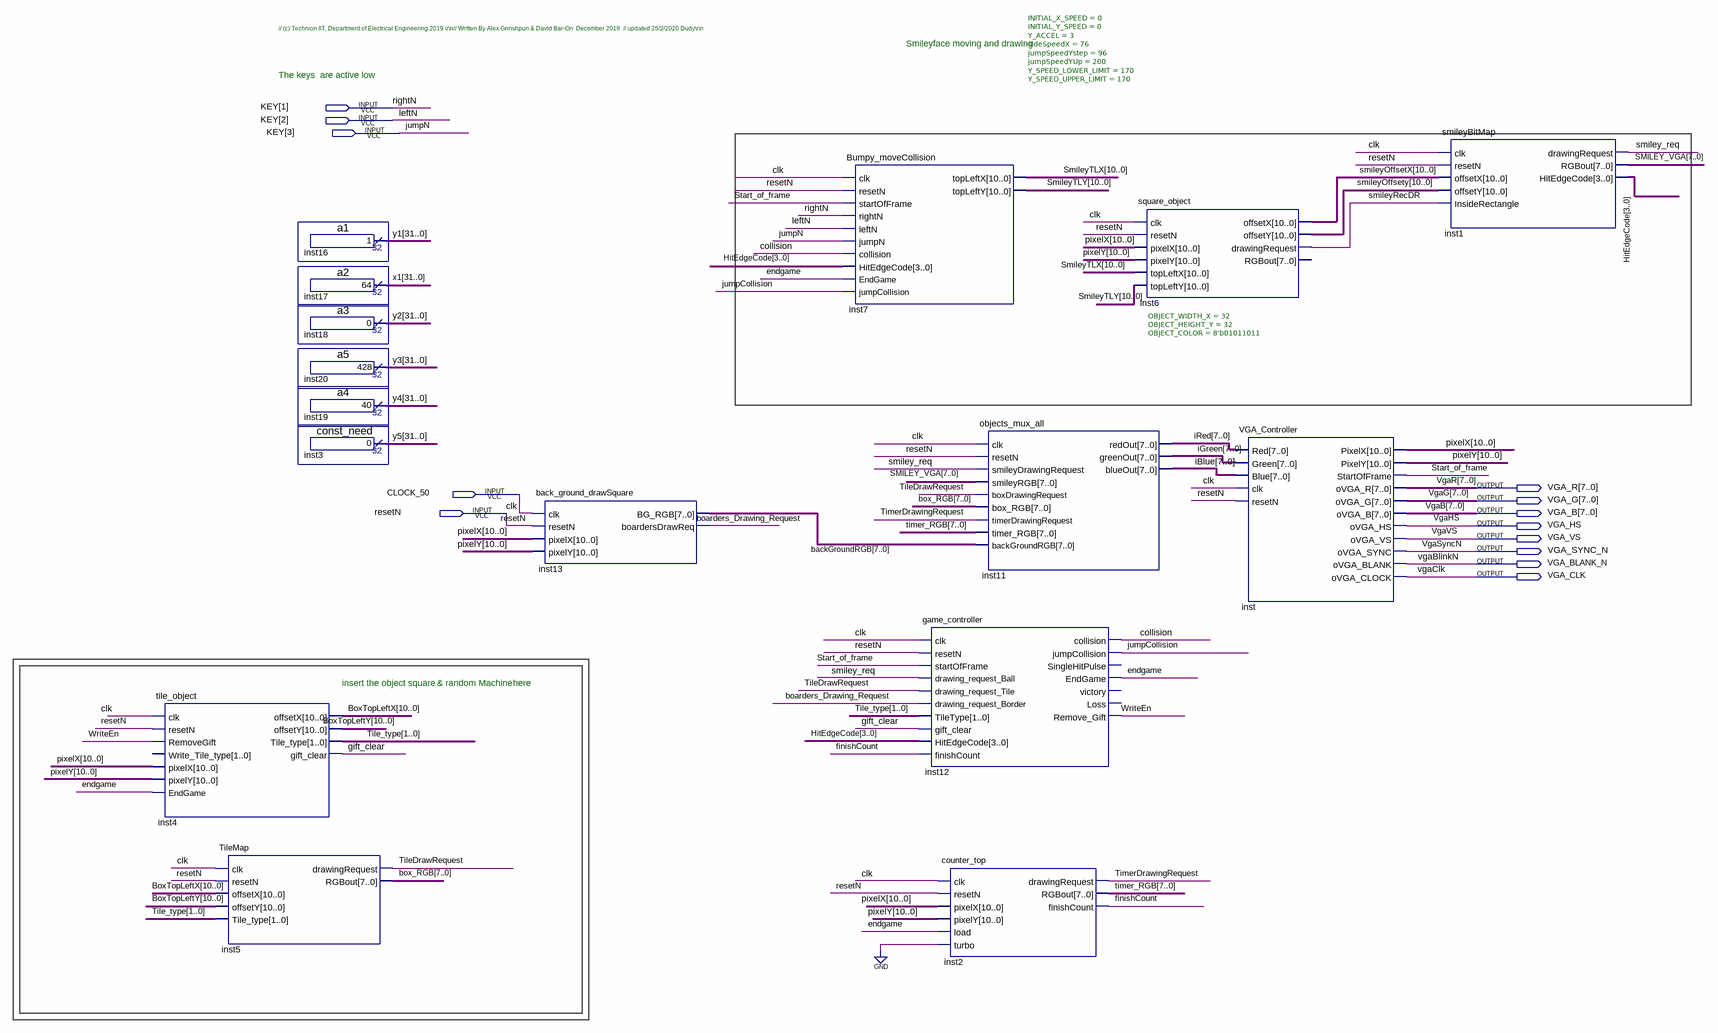
[diagram p0: schematic sheet]
// Quartus schematic top_project_demo.bdf as structural Verilog: 16 symbols, 13 pins
module top_project_demo (
  input  [3:1] KEY,
  input  CLOCK_50,
  input  resetN,
  output [7:0] VGA_R,
  output [7:0] VGA_G,
  output [7:0] VGA_B,
  output VGA_HS,
  output VGA_VS,
  output VGA_SYNC_N,
  output VGA_BLANK_N,
  output VGA_CLK
);

  wire boarders_Drawing_Request, collision, endgame, finishCount, gift_clear, jumpCollision, smiley_req,
       smileyRecDR, Start_of_frame, TileDrawRequest, TimerDrawingRequest, WriteEn;
  wire [1:0] Tile_type;
  wire [3:0] HitEdgeCode;
  wire [7:0] backGroundRGB, box_RGB, iBlue, iGreen, iRed, SMILEY_VGA, timer_RGB;
  wire [10:0] BoxTopLeftX, BoxTopLeftY, pixelX, pixelY, smileyOffsetX, smileyOffsety, SmileyTLX, SmileyTLY;
  wire [31:0] x1, y1, y2, y3, y4, y5;

  tile_object inst4 (
    .clk(CLOCK_50), .resetN(resetN), .RemoveGift(WriteEn), .pixelX(pixelX), .pixelY(pixelY),
    .EndGame(endgame), .offsetX(BoxTopLeftX), .offsetY(BoxTopLeftY), .Tile_type(Tile_type),
    .gift_clear(gift_clear));  // open: Write_Tile_type
  TileMap inst5 (
    .clk(CLOCK_50), .resetN(resetN), .offsetX(BoxTopLeftX), .offsetY(BoxTopLeftY), .Tile_type(Tile_type),
    .drawingRequest(TileDrawRequest), .RGBout(box_RGB));
  a1 inst16 (.result(y1));
  a2 inst17 (.result(x1));
  a3 inst18 (.result(y2));
  a5 inst20 (.result(y3));
  a4 inst19 (.result(y4));
  const_need inst3 (.result(y5));
  back_ground_drawSquare inst13 (
    .clk(CLOCK_50), .resetN(resetN), .pixelX(pixelX), .pixelY(pixelY), .BG_RGB(backGroundRGB),
    .boardersDrawReq(boarders_Drawing_Request));
  Bumpy_moveCollision #(.INITIAL_X_SPEED(0), .INITIAL_Y_SPEED(0), .Y_ACCEL(3), .sideSpeedX(76), .jumpSpeedYstep(96), .jumpSpeedYUp(200), .Y_SPEED_LOWER_LIMIT(170), .Y_SPEED_UPPER_LIMIT(170)) inst7 (
    .clk(CLOCK_50), .resetN(resetN), .startOfFrame(Start_of_frame), .rightN(KEY[1]), .leftN(KEY[2]),
    .jumpN(KEY[3]), .collision(collision), .HitEdgeCode(HitEdgeCode), .EndGame(endgame),
    .jumpCollision(jumpCollision), .topLeftX(SmileyTLX), .topLeftY(SmileyTLY));
  game_controller inst12 (
    .clk(CLOCK_50), .resetN(resetN), .startOfFrame(Start_of_frame), .drawing_request_Ball(smiley_req),
    .drawing_request_Tile(TileDrawRequest), .drawing_request_Border(boarders_Drawing_Request),
    .TileType(Tile_type), .gift_clear(gift_clear), .HitEdgeCode(HitEdgeCode), .finishCount(finishCount),
    .collision(collision), .jumpCollision(jumpCollision), .EndGame(endgame), .Remove_Gift(WriteEn));  // open: SingleHitPulse, victory, Loss
  counter_top inst2 (
    .clk(CLOCK_50), .resetN(resetN), .pixelX(pixelX), .pixelY(pixelY), .load(endgame), .turbo(1'b0),
    .drawingRequest(TimerDrawingRequest), .RGBout(timer_RGB), .finishCount(finishCount));
  objects_mux_all inst11 (
    .clk(CLOCK_50), .resetN(resetN), .smileyDrawingRequest(smiley_req), .smileyRGB(SMILEY_VGA),
    .boxDrawingRequest(TileDrawRequest), .box_RGB(box_RGB), .timerDrawingRequest(TimerDrawingRequest),
    .timer_RGB(timer_RGB), .backGroundRGB(backGroundRGB), .redOut(iRed), .greenOut(iGreen), .blueOut(iBlue));
  square_object #(.OBJECT_WIDTH_X(32), .OBJECT_HEIGHT_Y(32), .OBJECT_COLOR(8'b01011011)) inst6 (
    .clk(CLOCK_50), .resetN(resetN), .pixelX(pixelX), .pixelY(pixelY), .topLeftX(SmileyTLX),
    .topLeftY(SmileyTLY), .offsetX(smileyOffsetX), .offsetY(smileyOffsety), .drawingRequest(smileyRecDR));  // open: RGBout
  VGA_Controller inst (
    .Red(iRed), .Green(iGreen), .Blue(iBlue), .clk(CLOCK_50), .resetN(resetN), .PixelX(pixelX),
    .PixelY(pixelY), .StartOfFrame(Start_of_frame), .oVGA_R(VGA_R), .oVGA_G(VGA_G), .oVGA_B(VGA_B),
    .oVGA_HS(VGA_HS), .oVGA_VS(VGA_VS), .oVGA_SYNC(VGA_SYNC_N), .oVGA_BLANK(VGA_BLANK_N), .oVGA_CLOCK(VGA_CLK));
  smileyBitMap inst1 (
    .clk(CLOCK_50), .resetN(resetN), .offsetX(smileyOffsetX), .offsetY(smileyOffsety),
    .InsideRectangle(smileyRecDR), .drawingRequest(smiley_req), .RGBout(SMILEY_VGA), .HitEdgeCode(HitEdgeCode));

  // Other names for the same wires on the sheet: clk = CLOCK_50; jumpN = KEY[3]; leftN = KEY[2]; rightN = KEY[1];
  //   VgaB[7:0] = VGA_B; vgaBlinkN = VGA_BLANK_N; vgaClk = VGA_CLK; VgaG[7:0] = VGA_G; VgaHS = VGA_HS;
  //   VgaR[7:0] = VGA_R; VgaSyncN = VGA_SYNC_N; VgaVS = VGA_VS

  // Notes on the sheet:
  //   // (c) Technion IIT, Department of Electrical Engineering 2019 \r\n// Written By Alex Grinshpun & David Bar-On  December 2018  // updated 25/2/2020 Dudy\r\n
  //   Smileyface moving and drawing
  //   The keys  are active low
  //   insert the object square
  //   & random Machine
  //   here
endmodule
